# Altium schematic sheet IS42S16400J.SchDoc
size A; SheetNumber: 11; SheetTotal: 12
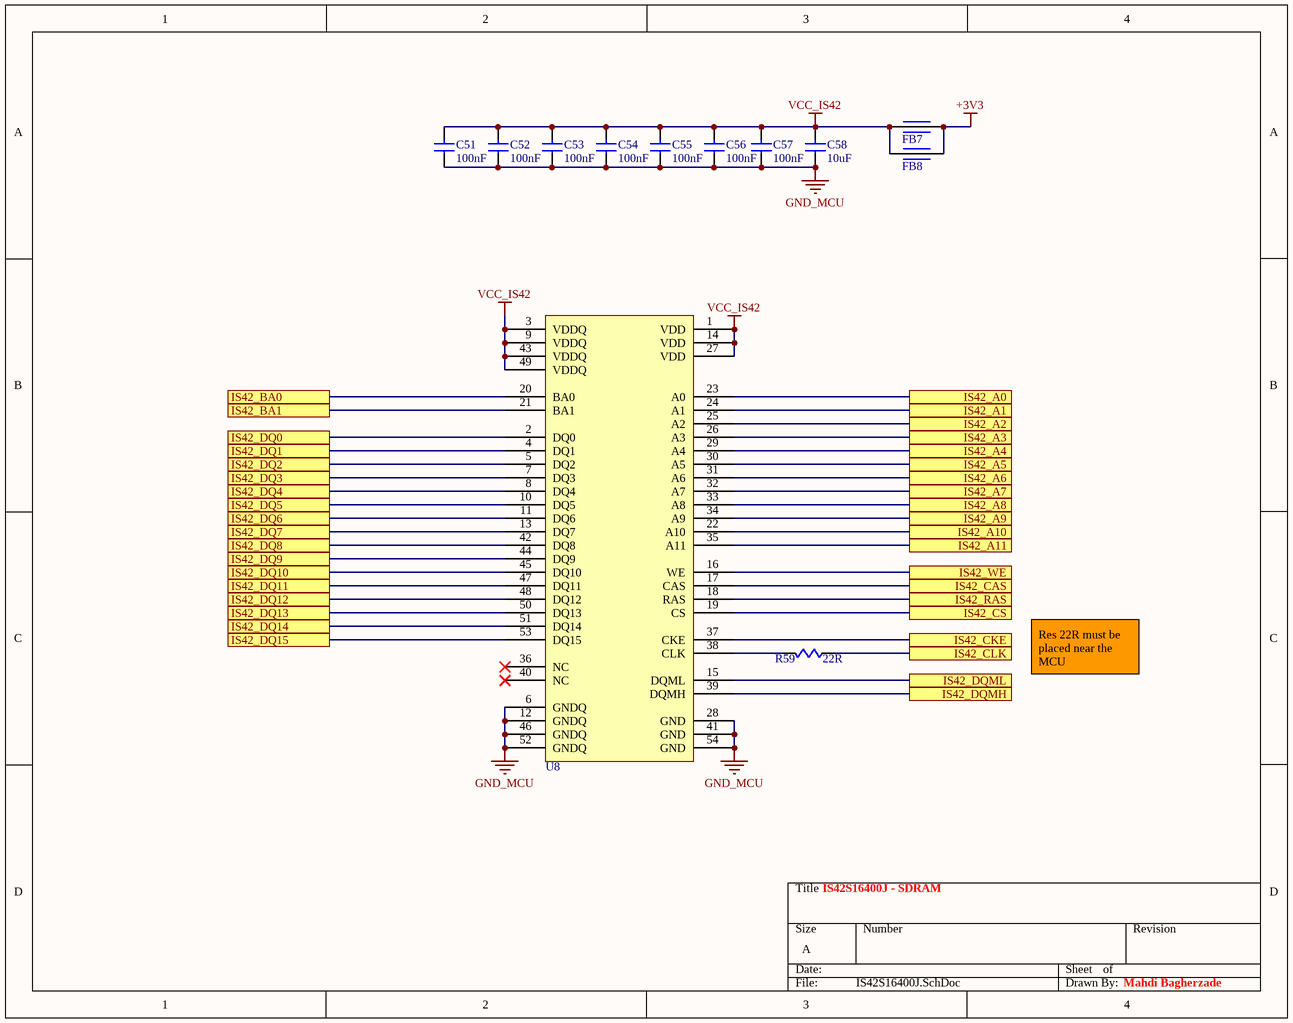
[diagram p0: IS42S16400J.SchDoc]

## Parts
C51  value 100nF  [C-0805]  (hidden comment: CAP Cer 100nF-50V-X7R-SMD)
C52  value 100nF  [C-0805]  (hidden comment: CAP Cer 100nF-50V-X7R-SMD)
C53  value 100nF  [C-0805]  (hidden comment: CAP Cer 100nF-50V-X7R-SMD)
C54  value 100nF  [C-0805]  (hidden comment: CAP Cer 100nF-50V-X7R-SMD)
C55  value 100nF  [C-0805]  (hidden comment: CAP Cer 100nF-50V-X7R-SMD)
C56  value 100nF  [C-0805]  (hidden comment: CAP Cer 100nF-50V-X7R-SMD)
C57  value 100nF  [C-0805]  (hidden comment: CAP Cer 100nF-50V-X7R-SMD)
C58  value 10uF  [C-0805]  (hidden comment: CAP Cer 10uF-50V-X7R-SMD)
FB7  Ferrite Bead SMD  [FB-0805]  (value not drawn)
FB8  Ferrite Bead SMD  [FB-0805]  (value not drawn)
R59  value 22R  [R-0805]  (hidden comment: RES 22R-5%-1/8W-SMD)
U8  IC IS42S16400J-7TLI-SMD  [TSSOP-54]  (value not drawn)

## Ports
IS42_A0 (see Interface[3C], MCU[5B]), IS42_A1 (see Interface[3C], MCU[5B]), IS42_A2 (see Interface[3D], MCU[5B]), IS42_A3 (see Interface[3D], MCU[5B]), IS42_A4 (see Interface[3D], MCU[5B]), IS42_A5 (see Interface[3D], MCU[5B]), IS42_A6 (see Interface[3D], MCU[5C]), IS42_A7 (see Interface[3D], MCU[5C]), IS42_A8 (see Interface[3D], MCU[5C]), IS42_A9 (see Interface[3D], MCU[5C]), IS42_A10 (see Interface[3D], MCU[3C]), IS42_A11 (see Interface[3D], MCU[3C]), IS42_BA0 (see Interface[3C], MCU[3C]), IS42_BA1 (see Interface[3C], MCU[3C]), IS42_CAS (see Interface[3D], MCU[3C]), IS42_CKE (see Interface[3D], MCU[3B]), IS42_CLK (see Interface[3D], MCU[3C]), IS42_CS (see Interface[3D], MCU[3B]), IS42_DQ0 (see Interface[3C], MCU[5B]), IS42_DQ1 (see Interface[3C], MCU[5B]), IS42_DQ2 (see Interface[3C], MCU[5A]), IS42_DQ3 (see Interface[3C], MCU[5A]), IS42_DQ4 (see Interface[3C], MCU[3B]), IS42_DQ5 (see Interface[3C], MCU[3C]), IS42_DQ6 (see Interface[3C], MCU[3C]), IS42_DQ7 (see Interface[3C], MCU[3C]), IS42_DQ8 (see Interface[3C], MCU[3C]), IS42_DQ9 (see Interface[3C], MCU[3C]), IS42_DQ10 (see Interface[3C], MCU[3C]), IS42_DQ11 (see Interface[3C], MCU[3C]), IS42_DQ12 (see Interface[3C], MCU[3C]), IS42_DQ13 (see Interface[3C], MCU[5B]), IS42_DQ14 (see Interface[3C], MCU[5B]), IS42_DQ15 (see Interface[3C], MCU[5B]), IS42_DQMH (see Interface[3D], MCU[3B]), IS42_DQML (see Interface[3D], MCU[3B]), IS42_RAS (see Interface[3D], MCU[5C]), IS42_WE (see Interface[3D], MCU[3A])

## Nets
+3V3: FB7.1 FB8.1
GND_MCU: C51.1 C52.1 C53.1 C54.1 C55.1 C56.1 C57.1 C58.1 U8.6(GNDQ) U8.12(GNDQ) U8.28(GND) U8.41(GND) U8.46(GNDQ) U8.52(GNDQ) U8.54(GND)
VCC_IS42: C51.2 C52.2 C53.2 C54.2 C55.2 C56.2 C57.2 C58.2 FB7.2 FB8.2 U8.1(VDD) U8.3(VDDQ) U8.9(VDDQ) U8.14(VDD) U8.27(VDD) U8.43(VDDQ) U8.49(VDDQ)
IS42_A0: U8.23(A0) ; port IS42_A0
IS42_A1: U8.24(A1) ; port IS42_A1
IS42_A2: U8.25(A2) ; port IS42_A2
IS42_A3: U8.26(A3) ; port IS42_A3
IS42_A4: U8.29(A4) ; port IS42_A4
IS42_A5: U8.30(A5) ; port IS42_A5
IS42_A6: U8.31(A6) ; port IS42_A6
IS42_A7: U8.32(A7) ; port IS42_A7
IS42_A8: U8.33(A8) ; port IS42_A8
IS42_A9: U8.34(A9) ; port IS42_A9
IS42_A10: U8.22(A10) ; port IS42_A10
IS42_A11: U8.35(A11) ; port IS42_A11
IS42_BA0: U8.20(BA0) ; port IS42_BA0
IS42_BA1: U8.21(BA1) ; port IS42_BA1
IS42_CAS: U8.17(CAS) ; port IS42_CAS
IS42_CKE: U8.37(CKE) ; port IS42_CKE
IS42_CLK: R59.1 ; port IS42_CLK
IS42_CS: U8.19(CS) ; port IS42_CS
IS42_DQ0: U8.2(DQ0) ; port IS42_DQ0
IS42_DQ1: U8.4(DQ1) ; port IS42_DQ1
IS42_DQ2: U8.5(DQ2) ; port IS42_DQ2
IS42_DQ3: U8.7(DQ3) ; port IS42_DQ3
IS42_DQ4: U8.8(DQ4) ; port IS42_DQ4
IS42_DQ5: U8.10(DQ5) ; port IS42_DQ5
IS42_DQ6: U8.11(DQ6) ; port IS42_DQ6
IS42_DQ7: U8.13(DQ7) ; port IS42_DQ7
IS42_DQ8: U8.42(DQ8) ; port IS42_DQ8
IS42_DQ9: U8.44(DQ9) ; port IS42_DQ9
IS42_DQ10: U8.45(DQ10) ; port IS42_DQ10
IS42_DQ11: U8.47(DQ11) ; port IS42_DQ11
IS42_DQ12: U8.48(DQ12) ; port IS42_DQ12
IS42_DQ13: U8.50(DQ13) ; port IS42_DQ13
IS42_DQ14: U8.51(DQ14) ; port IS42_DQ14
IS42_DQ15: U8.53(DQ15) ; port IS42_DQ15
IS42_DQMH: U8.39(DQMH) ; port IS42_DQMH
IS42_DQML: U8.15(DQML) ; port IS42_DQML
IS42_RAS: U8.18(RAS) ; port IS42_RAS
IS42_WE: U8.16(WE) ; port IS42_WE
NetR59_2: R59.2 U8.38(CLK)

Not connected (* = marked no-connect by the designer): U8 36(NC)* 40(NC)*

## Notes on the sheet
- Res 22R must be placed near the MCU
- IS42S16400J - SDRAM
- Mahdi Bagherzade

## Library data of the parts
C51-C58 = CAP-CER: CAPACITOR; Phone Number: 0915 8700 314; Voltage: 50V; Tolerance: X7R; Type: SMD; Publisher: Mahdi Bagherzadeh; ComponentLink1Description: Linkedin; ComponentLink1URL: https://ir.linkedin.com/in/mahdi-bagherzade; Published Date: 9-15-2024
FB7 FB8 = FERRITE BEAD: INDUCATOR; Phone Number: 0915 8700 314; Publisher: Mahdi Bagherzadeh; ComponentLink1Description: Linkedin; ComponentLink1URL: https://ir.linkedin.com/in/mahdi-bagherzade; Published Date: 9-15-2024; Type: SMD
R59 = RES: RESISTOR; Phone Number: 0915 8700 314; Power: 1/8W; Tolerance: 5%; Publisher: Mahdi Bagherzadeh; ComponentLink1Description: Linkedin; ComponentLink1URL: https://ir.linkedin.com/in/mahdi-bagherzade; Published Date: 9-15-2024; Type: SMD
U8 = IS42S16400J-7TLI: IC; Phone Number: 0915 8700 314; Publisher: Mahdi Bagherzadeh; ComponentLink1Description: Linkedin; ComponentLink1URL: https://ir.linkedin.com/in/mahdi-bagherzade; Published Date: 9-15-2024; Code: IS42S16400J-7TLI; Type: SMD